# Altium project RandomNumberGenerator.PrjPcb
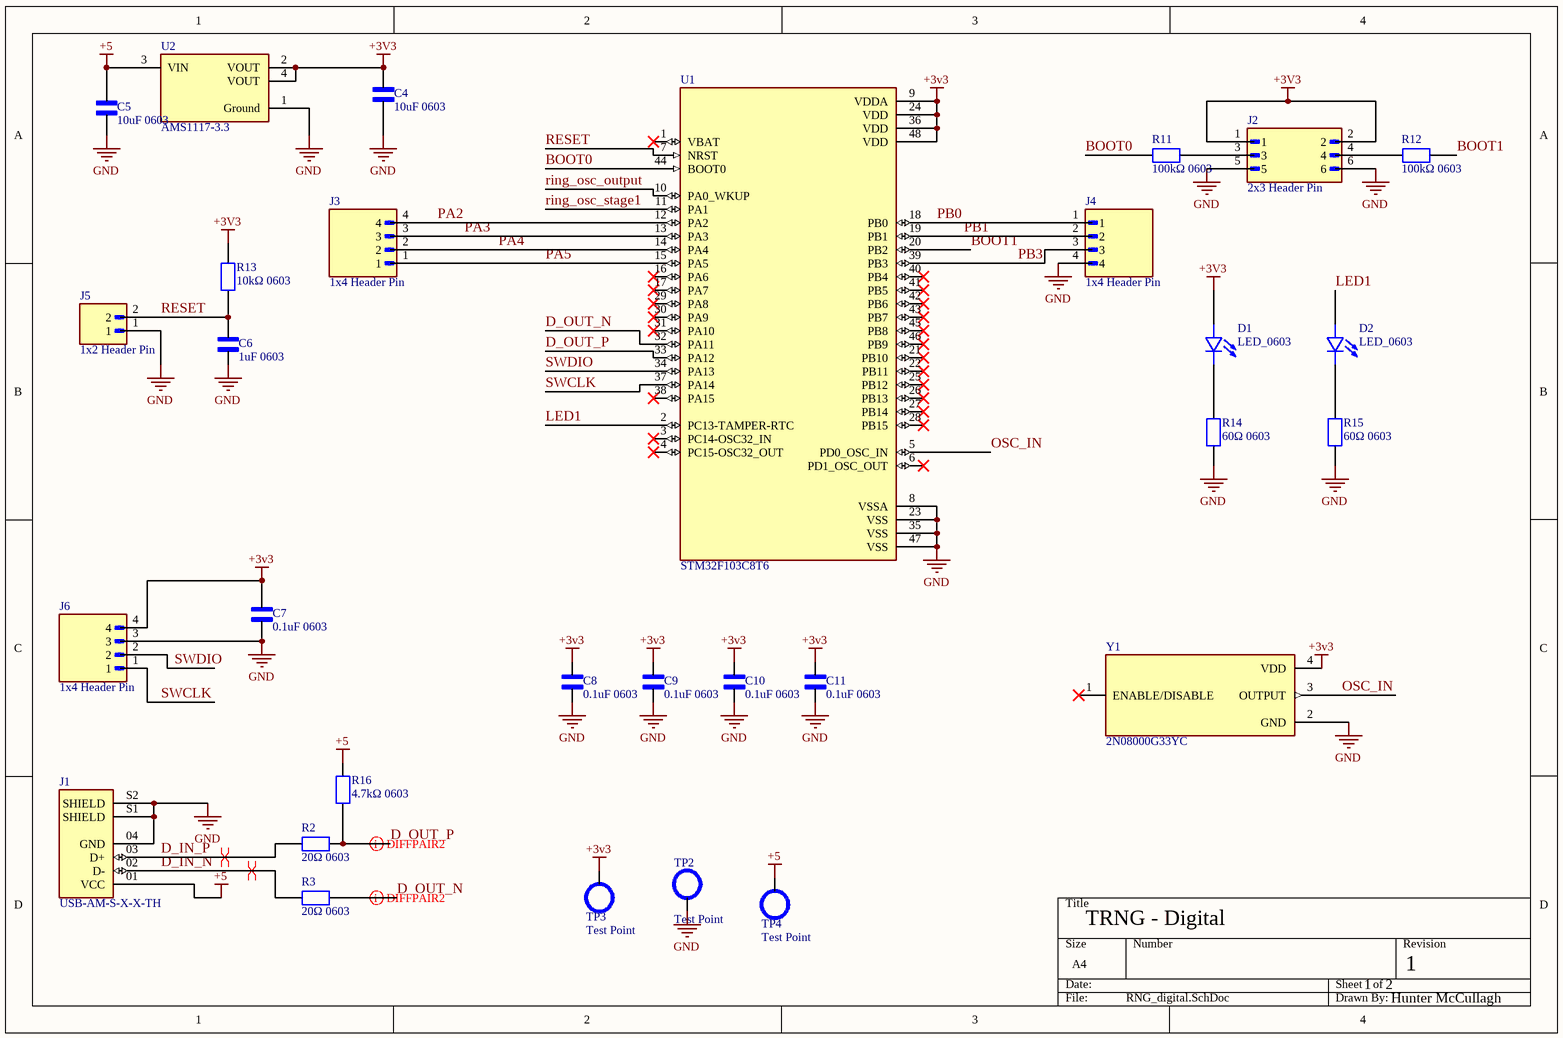
[diagram p0: RNG_digital.SchDoc]
2 sheets, 53 parts. Net scope: global (net labels, ports and power ports of the same name join across sheets).
Board file: RNG_pcb.PcbDoc
Sheets:
  RNG_digital.SchDoc
  RNG_entropy.SchDoc

## Sheet RNG_digital.SchDoc
size A4; SheetNumber: 1; SheetTotal: 2

### Parts
C4  10uF 0603  [0603 PACKAGE]
C5  10uF 0603  [0603 PACKAGE]
C6  1uF 0603  [0603 PACKAGE]
C7  0.1uF 0603  [0603 PACKAGE]
C8  0.1uF 0603  [0603 PACKAGE]
C9  0.1uF 0603  [0603 PACKAGE]
C10  0.1uF 0603  [0603 PACKAGE]
C11  0.1uF 0603  [0603 PACKAGE]
D1  LED_0603  [LED_KT-0603R]
D2  LED_0603  [LED_KT-0603R]
J1  USB-AM-S-X-X-TH  [SAMTEC_USB-AM-S-X-X-TH]
J2  2x3 Header Pin  [2x3 Jumper]
J3  1x4 Header Pin  [1x4 Jumper]
J4  1x4 Header Pin  [1x4 Jumper]
J5  1x2 Header Pin  [1x2 Jumper]
J6  1x4 Header Pin  [1x4 Jumper]
R2  20Ω 0603  [0603 PACKAGE]
R3  20Ω 0603  [0603 PACKAGE]
R11  100kΩ 0603  [0603 PACKAGE]
R12  100kΩ 0603  [0603 PACKAGE]
R13  10kΩ 0603  [0603 PACKAGE]
R14  60Ω 0603  [0603 PACKAGE]
R15  60Ω 0603  [0603 PACKAGE]
R16  4.7kΩ 0603  [0603 PACKAGE]
TP2  Test Point  [Test Point]
TP3  Test Point  [Test Point]
TP4  Test Point  [Test Point]
U1  STM32F103C8T6  [QFP50P900X900X160-48N]
U2  AMS1117-3.3  [FP-AMS1117-IPC_C]
Y1  2N08000G33YC  [OSC_S12505T-8.000-X-R]

### Nets
+3v3: C4.2 C7.2 C8.2 C9.2 C10.2 C11.2 D1.A J2.1 J2.2 J6.4 R13.2 TP3.1 U1.9(VDDA) U1.24(VDD) U1.36(VDD) U1.48(VDD) U2.2(VOUT) U2.4(VOUT) Y1.4(VDD)
+5: C5.2 J1.01(VCC) R16.2 TP4.1 U2.3(VIN)
GND: C4.1 C5.1 C6.1 C7.1 C8.1 C9.1 C10.1 C11.1 J1.04(GND) J1.S1(SHIELD) J1.S2(SHIELD) J2.5 J2.6 J4.4 J5.1 J6.3 R14.2 R15.2 TP2.1 U1.8(VSSA) U1.23(VSS) U1.35(VSS) U1.47(VSS) U2.1(Ground) Y1.2(GND)
BOOT0: R11.1 U1.44(BOOT0)
BOOT1: R12.2 U1.20(PB2)
D_IN_N: J1.02(D-) R3.1
D_IN_P: J1.03(D+) R2.1
D_OUT_N: R3.2 U1.32(PA11)
D_OUT_P: R2.2 R16.1 U1.33(PA12)
LED1: D2.A U1.2(PC13-TAMPER-RTC)
OSC_IN: U1.5(PD0_OSC_IN) Y1.3(OUTPUT)
PA2: J3.4 U1.12(PA2)
PA3: J3.3 U1.13(PA3)
PA4: J3.2 U1.14(PA4)
PA5: J3.1 U1.15(PA5)
PB0: J4.1 U1.18(PB0)
PB1: J4.2 U1.19(PB1)
PB3: J4.3 U1.39(PB3)
RESET: C6.2 J5.2 R13.1 U1.7(NRST)
ring_osc_output: U1.10(PA0_WKUP)
ring_osc_stage1: U1.11(PA1)
SWCLK: J6.1 U1.37(PA14)
SWDIO: J6.2 U1.34(PA13)
NetD1_C: D1.C R14.1
NetD2_C: D2.C R15.1
NetJ2_3: J2.3 R11.2
NetJ2_4: J2.4 R12.1

Not connected (* = marked no-connect by the designer): U1 1(VBAT)* 3(PC14-OSC32_IN)* 4(PC15-OSC32_OUT)* 6(PD1_OSC_OUT)* 16(PA6)* 17(PA7)* 21(PB10)* 22(PB11)* 25(PB12)* 26(PB13)* 27(PB14)* 28(PB15)* 29(PA8)* 30(PA9)* 31(PA10)* 38(PA15)* 40(PB4)* 41(PB5)* 42(PB6)* 43(PB7)* 45(PB8)* 46(PB9)*; Y1 1(ENABLE/DISABLE)*

### Layout directives
differential pair; differential pair class *: D_IN_P
differential pair: D_IN_N, D_OUT_N, D_OUT_P

### Notes on the sheet
- TRNG - Digital
- 1    2
- 1
- Hunter McCullagh

### Library data of the parts
C4-C11 = 0603_Capacitor
D1 D2 = LED_0603: Red 0603 Light Emitting Diodes; MF: Hubei KENTO Elec; MP: KT-0603R; SnapEDA_Link: https://www.snapeda.com/parts/KT-0603R/Hubei+KENTO+Elec/view-part/?ref=snap; Package: Package; Value: *; Check_prices: https://www.snapeda.com/parts/KT-0603R/Hubei+KENTO+Elec/view-part/?ref=eda
J1 = USB-AM-S-X-X-TH: USB Connectors USB 2.0 Interface, Type A; MF: Samtec; MP: USB-AM-S-S-W-TH; Value: *; SnapEDA_Link: https://www.snapeda.com/parts/USB-AM-S-S-W-TH/Samtec/view-part/?ref=snap; Purchase-URL: https://pricing.snapeda.com/search/part/USB-AM-S-S-W-TH/?ref=eda; Availability: In Stock; Price: None; Package: None; Check_prices: https://www.snapeda.com/parts/USB-AM-S-S-W-TH/Samtec/view-part/?ref=eda
J2 = 2x3 Header Pin: MP: M20-9980346; Package: None; Price: None; Value: *; Availability: Unavailable
J3 J4 J6 = 1x4 Header Pin: 2.54mm (0.1) Pitch SIL Vertical Throughboard Pin Header, 7mm mating pin height, tin, 4 contacts; MF: Harwin; MP: M20-9730446; SnapEDA_Link: https://www.snapeda.com/parts/M20-9730446/Harwin/view-part/?ref=snap; Package: None; Value: *; Check_prices: https://www.snapeda.com/parts/M20-9730446/Harwin/view-part/?ref=eda
J5 = 1x2 Header Pin: 2.54mm (0.1) Pitch SIL Vertical Throughboard Pin Header, 6.1mm mating pin height, tin, 2 contacts; MF: Harwin; MP: M20-9990246; SnapEDA_Link: https://www.snapeda.com/parts/M20-9990246/Harwin/view-part/?ref=snap; Package: None; Value: *; Check_prices: https://www.snapeda.com/parts/M20-9990246/Harwin/view-part/?ref=eda
R2 R3 R11-R16 = 0603_Resistor
U1 = STM32F103C8T6: ARM® Cortex®-M3 STM32F1 Microcontroller IC 32-Bit 72MHz 64KB (64K x 8) FLASH 48-LQFP (7x7); MF: STMicroelectronics; SnapEDA_Link: https://www.snapeda.com/parts/STM32F103C8T6/STMicroelectronics/view-part/?ref=snap; Package: LQFP-48 STMicroelectronics; Value: *; MP: STM32F103C8T6; Check_prices: https://www.snapeda.com/parts/STM32F103C8T6/STMicroelectronics/view-part/?ref=eda
U2 = CMP-209535-000001-1: LDO Voltage Regulators 1A, 3.3V; Manufacturer: Advanced Monolithic Systems; Dropout Voltage: 1.1V; Output Type: Fixed; Nominal Supply Current: 5mA; Max Power Dissipation: 1.2W; Max Supply Voltage: 15V; Number Of Outputs: 1; Standoff Height: 0.64mm; Max Junction Temp: +125°C; Height: 1.8mm; Package: AMS1117; Device Class L2: Power Management ICs; ComponentLink2Description: Datasheet; ComponentLink2URL: http://www.advanced-monolithic.com/pdf/ds1117.pdf; Category: IC; RoHS: TRUE; Automotive: No; Device Class L1: Integrated Circuits (ICs); Output Current: 1A; Device Class L3: Voltage Regulators - Linear; Temperature: -40°C to +125°C; Output Voltage: 3.3V; Manufacturer Part Number: AMS1117-3.3; Temperature Range Low: -40°C; Octopart: https://octopart.com/ams1117-3.3-advanced+monolithic+systems-25899300; Lead Free: Yes; Ipc Land Pattern Name: SOT229P700X180-4; Temperature Range High: +125°C
Y1 = CrystalOscillator_SMD2520-4P: MP: S12505T-8.000-X-R; Package: None; Price: None; Value: *; Availability: Unavailable

## Sheet RNG_entropy.SchDoc
size A4; SheetNumber: 2; SheetTotal: 2
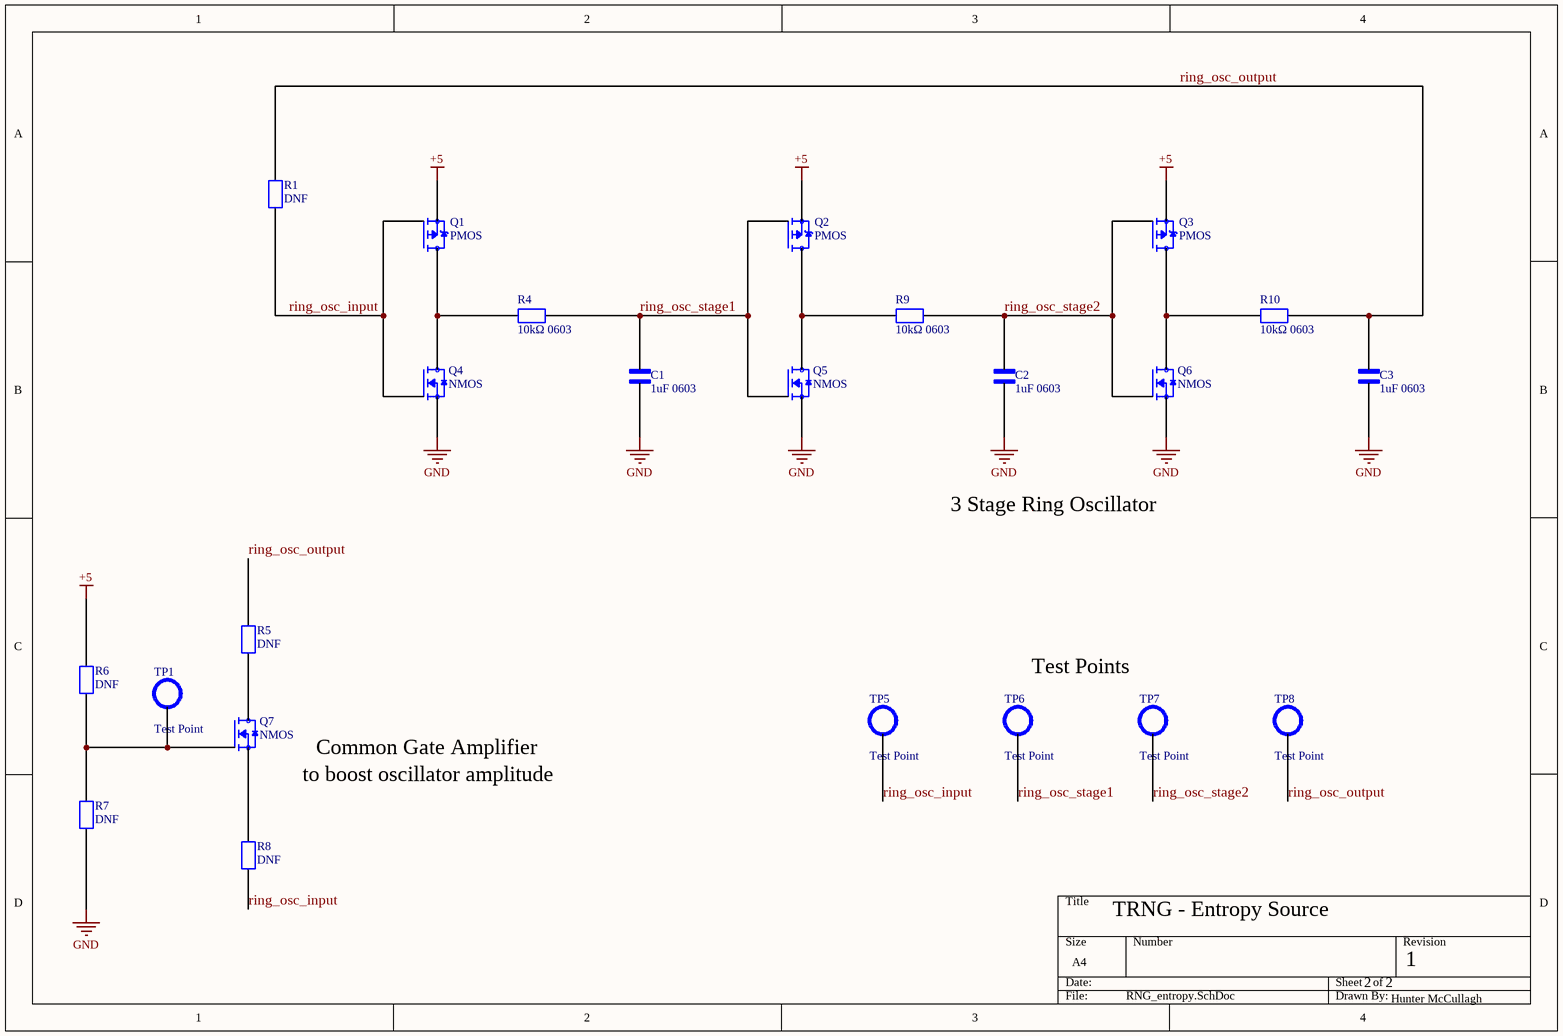
[diagram p1: RNG_entropy.SchDoc]

### Parts
C1  1uF 0603  [0603 PACKAGE]
C2  1uF 0603  [0603 PACKAGE]
C3  1uF 0603  [0603 PACKAGE]
Q1  PMOS  [SOT23-3]
Q2  PMOS  [SOT23-3]
Q3  PMOS  [SOT23-3]
Q4  NMOS  [SOT23-3]
Q5  NMOS  [SOT23-3]
Q6  NMOS  [SOT23-3]
Q7  NMOS  [SOT23-3]
R1  DNF  [0402 PACKAGE]
R4  10kΩ 0603  [0603 PACKAGE]
R5  DNF  [0402 PACKAGE]
R6  DNF  [0603 PACKAGE]
R7  DNF  [0603 PACKAGE]
R8  DNF  [0402 PACKAGE]
R9  10kΩ 0603  [0603 PACKAGE]
R10  10kΩ 0603  [0603 PACKAGE]
TP1  Test Point  [Test Point]
TP5  Test Point  [Test Point]
TP6  Test Point  [Test Point]
TP7  Test Point  [Test Point]
TP8  Test Point  [Test Point]

### Nets
+5: Q1.2(S) Q2.2(S) Q3.2(S) R6.2
GND: C1.1 C2.1 C3.1 Q4.2(S) Q5.2(S) Q6.2(S) R7.1
ring_osc_input: Q1.1(G) Q4.1(G) R1.1 R8.1 TP5.1
ring_osc_output: C3.2 R1.2 R5.2 R10.2 TP8.1
ring_osc_stage1: C1.2 Q2.1(G) Q5.1(G) R4.2 TP6.1
ring_osc_stage2: C2.2 Q3.1(G) Q6.1(G) R9.2 TP7.1
NetQ1_3: Q1.3(D) Q4.3(D) R4.1
NetQ2_3: Q2.3(D) Q5.3(D) R9.1
NetQ3_3: Q3.3(D) Q6.3(D) R10.1
NetQ7_1: Q7.1(G) R6.1 R7.2 TP1.1
NetQ7_2: Q7.2(S) R8.2
NetQ7_3: Q7.3(D) R5.1

### Notes on the sheet
- 3 Stage Ring Oscillator
- Test Points
- to boost oscillator amplitude
- Common Gate Amplifier
- TRNG - Entropy Source
- 2    2
- 1
- Hunter McCullagh

### Library data of the parts
C1-C3 = 0603_Capacitor
Q1-Q3 = AO3401A: P-Channel 30 V 4A (Ta) 1.4W (Ta) Surface Mount SOT-23-3; MF: Alpha & Omega Semiconductor; SnapEDA_Link: https://www.snapeda.com/parts/AO3401A/Alpha/view-part/?ref=snap; Package: SOT-23 Alpha &amp; Omega Semiconductor; Value: *; MP: AO3401A; Check_prices: https://www.snapeda.com/parts/AO3401A/Alpha/view-part/?ref=eda
Q4-Q7 = AO3400A: N-Channel 30 V 5.7A (Ta) 1.4W (Ta) Surface Mount SOT-23-3; MF: Alpha & Omega Semiconductor; SnapEDA_Link: https://www.snapeda.com/parts/AO3400A/Alpha/view-part/?ref=snap; Package: SOT-23 Alpha &amp; Omega Semiconductor Inc.; Value: *; MP: AO3400A; Check_prices: https://www.snapeda.com/parts/AO3400A/Alpha/view-part/?ref=eda
R1 R5 R8 = 0402_Resistor
R4 R6 R7 R9 R10 = 0603_Resistor

## Nets that join several sheets
+5: RNG_digital (5 pins), RNG_entropy (Q1.2 Q2.2 Q3.2 R6.2)
GND: RNG_digital (25 pins), RNG_entropy (7 pins)
ring_osc_output: RNG_digital (U1.10), RNG_entropy (5 pins)
ring_osc_stage1: RNG_digital (U1.11), RNG_entropy (5 pins)